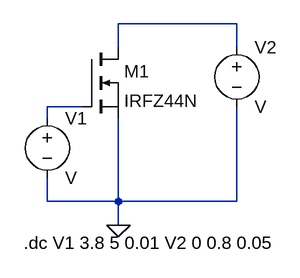
[diagram p0: schematic DC_Sweep.asc]
DC_Sweep.asc, the LTspice schematic file:
Version 4
SHEET 1 1496 740
WIRE 352 80 192 80
WIRE 192 112 192 80
WIRE 352 112 352 80
WIRE 144 192 96 192
WIRE 96 208 96 192
WIRE 96 320 96 288
WIRE 192 320 192 208
WIRE 192 320 96 320
WIRE 352 320 352 192
WIRE 352 320 192 320
WIRE 192 352 192 320
FLAG 192 352 0
SYMBOL nmos 144 112 R0
SYMATTR InstName M1
SYMATTR Value IRFZ44N
SYMBOL voltage 96 192 R0
SYMATTR InstName V1
SYMBOL voltage 352 96 R0
SYMATTR InstName V2
TEXT 64 376 Left 2 !.dc V1 3.8 5 0.01 V2 0 0.8 0.05

The netlist it stands for:
* DC_Sweep.asc
M1 N001 N002 0 0 IRFZ44N
V1 N002 0 V
V2 N001 0 V
.model NMOS NMOS
.model PMOS PMOS
.lib standard.mos
.dc V1 3.8 5 0.01 V2 0 0.8 0.05
.backanno
.end